# EasyEDA schematic LinefollowerAmateur.json
TITLE: Sheet_1; REV: 1.0; Date: 2025-04-01; Sheet: 1/1; Company: Your Company
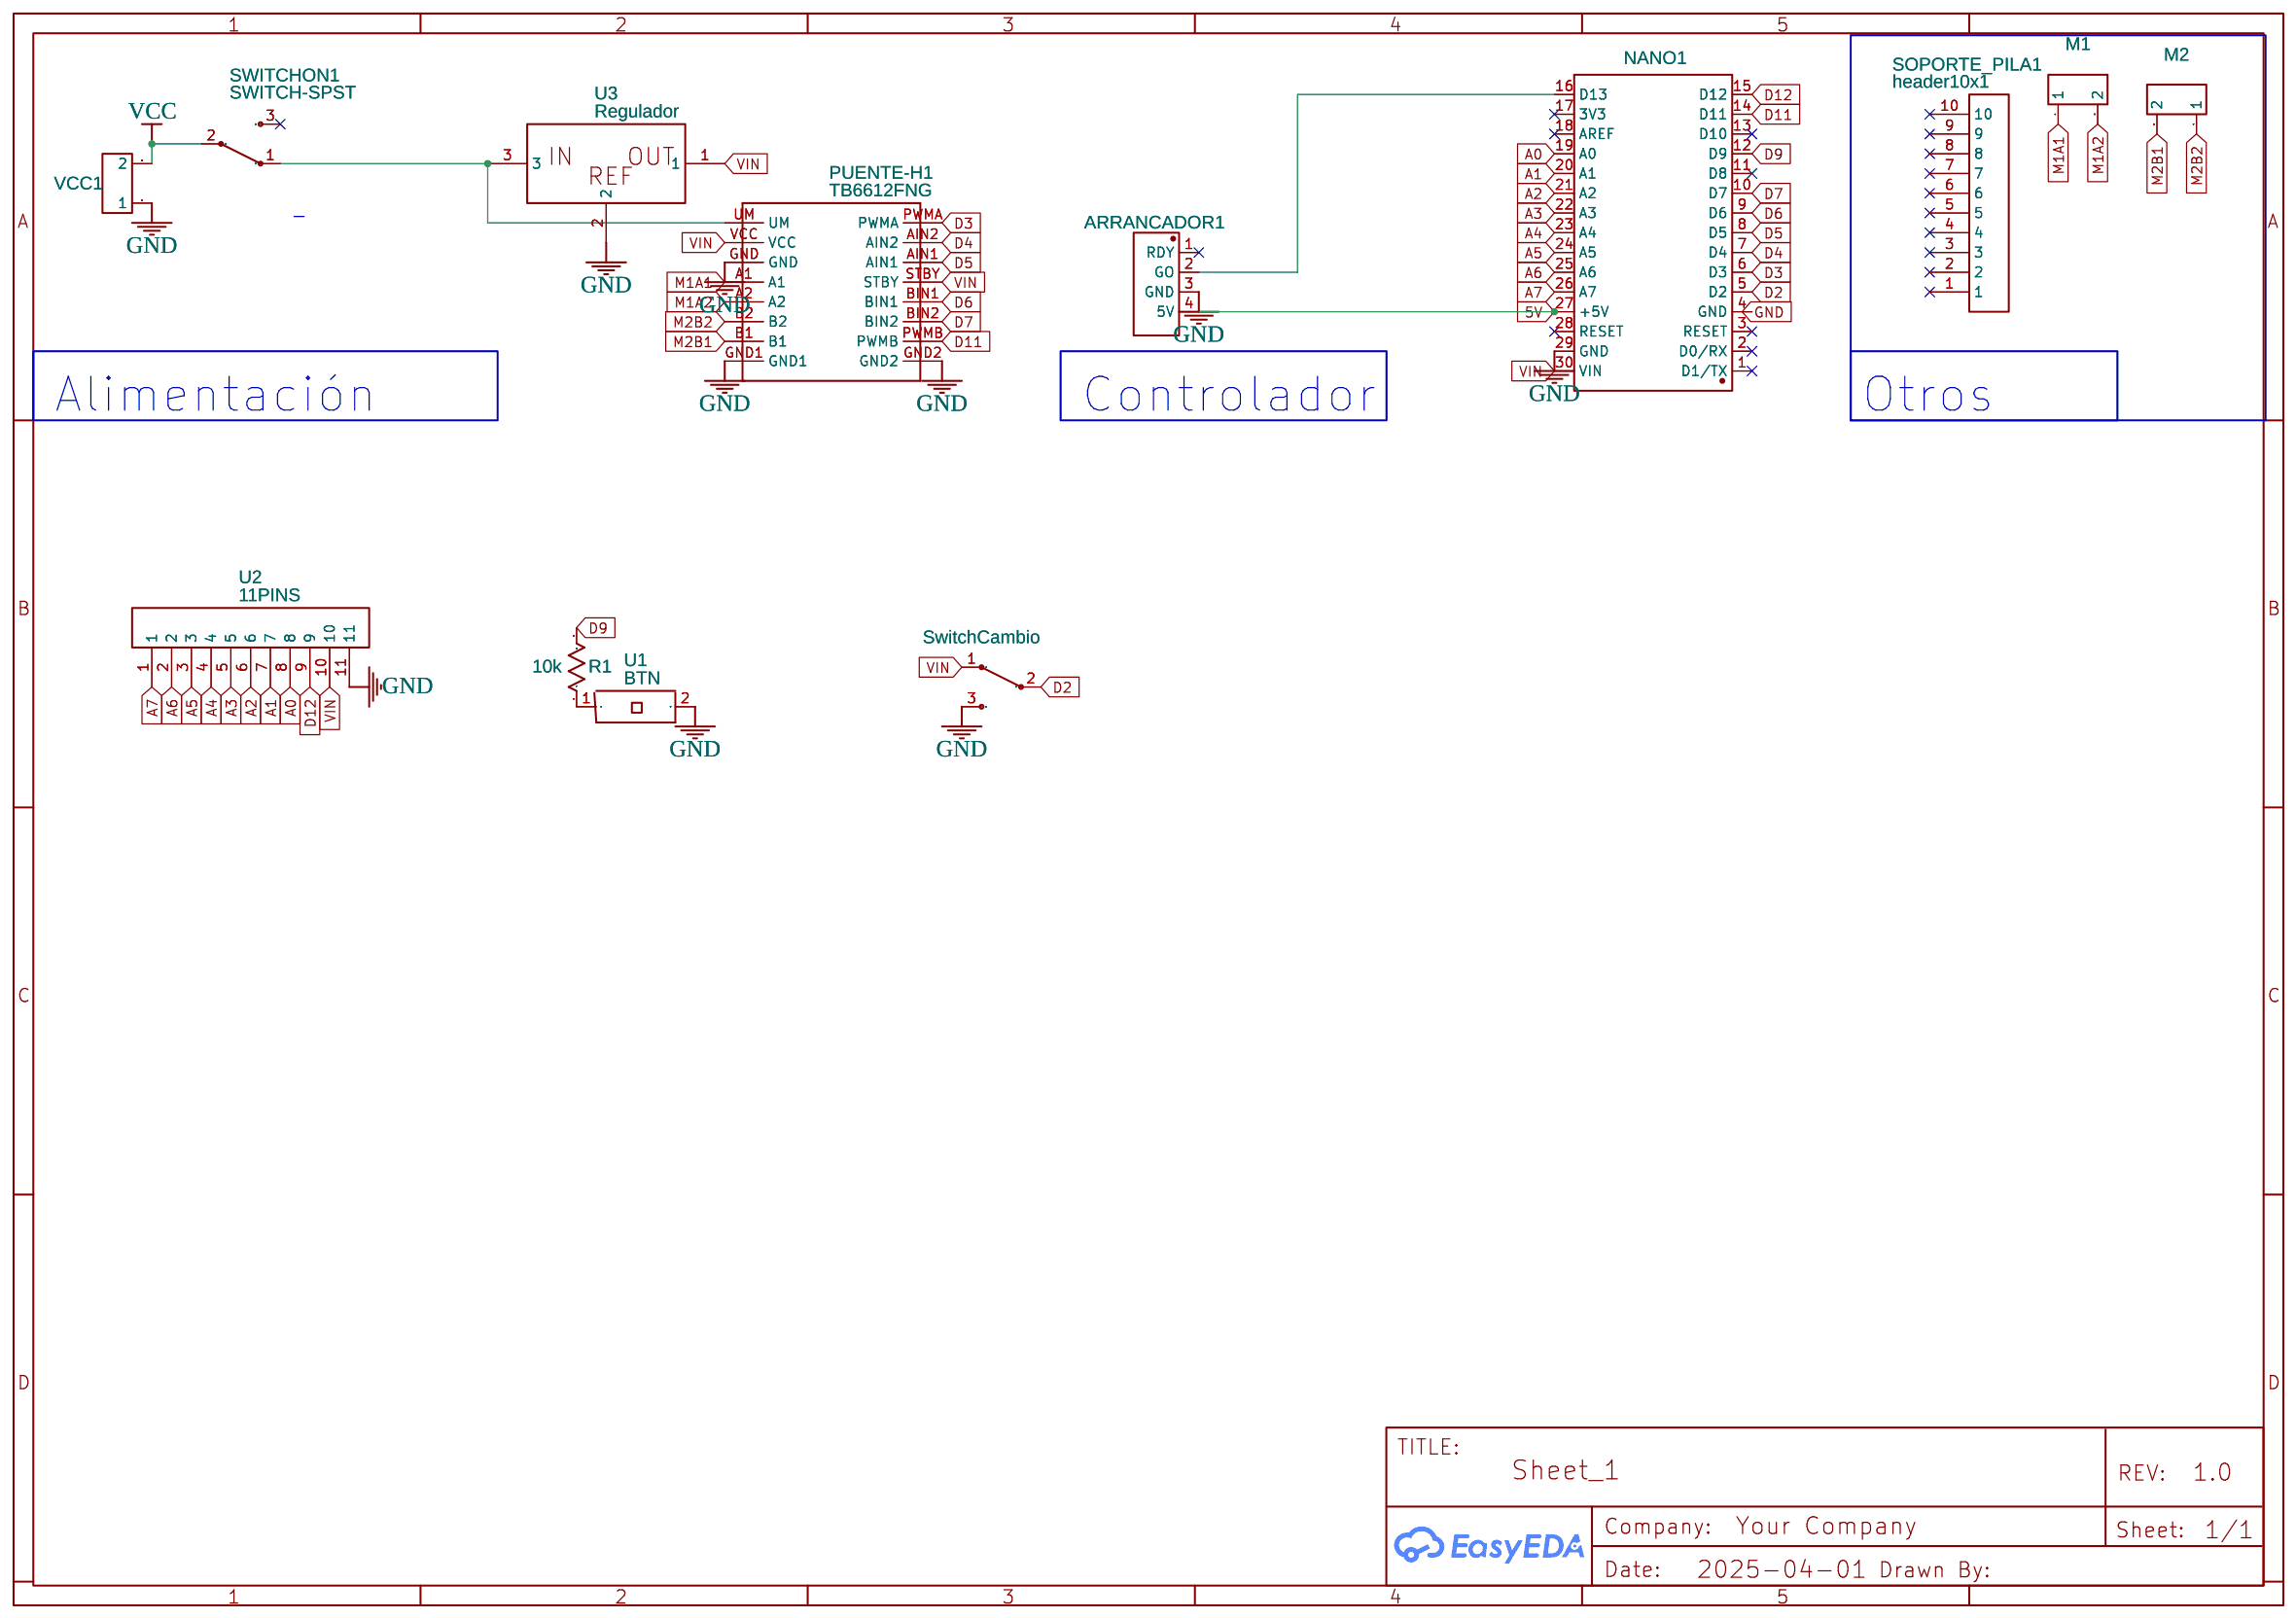
[diagram p0: schematic sheet]

## Parts
ARRANCADOR1  HEADER 1X4P COPY  [HEADER - HEADER-FEMALE-2.54_1X4]
M1  CONNECTOR 2 PINS  [CONNECTOR_PINHEADER_2.54MM:PINHEADER_1X11_P_2.54MM]
M2  CONNECTOR 2 PINS  [CONNECTOR_PINHEADER_2.54MM:PINHEADER_1X11_P_2.54MM]
NANO1  ARDUINO_NANO  [COMM-TH_ARDUINO_NANO]
PUENTE-H1  TB6612FNG  [TB6612FNG]
R1  10k  [PKG-0.25W RESISTOR]
SOPORTE_PILA1  header10x1  [HEADER10X1]
SWITCHCAMBIO1  SwitchCambio  [SWITCH-SPST]
SWITCHON1  SWITCH-SPST  [SWITCH-SPST]
U1  BTN  [BTN]
U2  11PINS  [11PINS]
U3  Regulador  [REGULADOR]
VCC1  CONNECTOR 2 PINS  [CONNECTOR_PINHEADER_2.54MM:PINHEADER_1X11_P_2.54MM]

## Library data of the parts
ARRANCADOR1 = HEADER 1X4P COPY: Contributor: trananhkha2406; Supplier: Sparkfun
M1 M2 VCC1 = HEADER PAD 2X: Manufacturer: BOOMELE; Manufacturer Part: Female headerHDR1X8-2.54; Supplier Part: C27438; JLCPCB Part Class: Extended Part; Contributor: papisdieng22
NANO1 = ARDUINO_NANO: Supplier: LCSC; Supplier Part: C9900017879; Manufacturer: null; JLCPCB Part Class: Extended Part; Contributor: lcsc
PUENTE-H1 = TB6612FNG: Contributor: 3D Mr.
R1 = 10k: Power: 1/4W; Tolerance: ±5%; Supplier Part: 9339116; Supplier: Element14; Manufacturer: MULTICOMP; Manufacturer Part: RESISTOR_ALONG; Link: http://www.farnell.com/datasheets/1716725.pdf?_ga=2.130313612.2023696496.1506695686-238689616.1505921947&_gac=1.45287312.1506011718.EAIaIQobChMI57GX6tq21gIVTzobCh2WXgT2EAAYASAAEgKn9_D_BwE; Contributor: Matheus Alecrim
SOPORTE_PILA1 = header10x1: Contributor: elfred
SWITCHCAMBIO1 SWITCHON1 = SWITCH-SPST: sourceId: ceKgMGAuL; Contributor: Sascha Dahten
U1 = BTN: Contributor: clanganke
U2 = 11PINS: Contributor: Chinz
U3 = Regulador: Contributor: miguelcrego

## Nets
5V: ARRANCADOR1.4(5V) NANO1.27(+5V)
GND: ARRANCADOR1.3(GND) NANO1.4(GND) NANO1.29(GND) PUENTE-H1.GND PUENTE-H1.GND1 PUENTE-H1.GND2 SWITCHCAMBIO1.3 U1.2 U2.11 U3.2 VCC1.1
VCC: SWITCHON1.2 VCC1.2
VIN: NANO1.30(VIN) PUENTE-H1.STBY PUENTE-H1.VCC SWITCHCAMBIO1.1 U2.10 U3.1
A0: NANO1.19(A0) U2.8
A1: NANO1.20(A1) U2.7
A2: NANO1.21(A2) U2.6
A3: NANO1.22(A3) U2.5
A4: NANO1.23(A4) U2.4
A5: NANO1.24(A5) U2.3
A6: NANO1.25(A6) U2.2
A7: NANO1.26(A7) U2.1
D2: NANO1.5(D2) SWITCHCAMBIO1.2
D3: NANO1.6(D3) PUENTE-H1.PWMA
D4: NANO1.7(D4) PUENTE-H1.AIN2
D5: NANO1.8(D5) PUENTE-H1.AIN1
D6: NANO1.9(D6) PUENTE-H1.BIN1
D7: NANO1.10(D7) PUENTE-H1.BIN2
D9: NANO1.12(D9) R1.2
D11: NANO1.14(D11) PUENTE-H1.PWMB
D12: NANO1.15(D12) U2.9
M1A1: M1.1 PUENTE-H1.A1
M1A2: M1.2 PUENTE-H1.A2
M2B1: M2.2 PUENTE-H1.B1
M2B2: M2.1 PUENTE-H1.B2
Net-(ARRANCADOR1-2): ARRANCADOR1.2(GO) NANO1.16(D13)
Net-(PUENTE-H1-UM): PUENTE-H1.UM SWITCHON1.1 U3.3
Net-(R1-1): R1.1 U1.1

Not connected (* = marked no-connect by the designer): ARRANCADOR1 1(RDY)*; NANO1 1(D1/TX)* 2(D0/RX)* 3(RESET)* 11(D8)* 13(D10)* 17(3V3)* 18(AREF)* 28(RESET)*; SOPORTE_PILA1 1* 2* 3* 4* 5* 6* 7* 8* 9* 10*; SWITCHON1 3*

## Notes on the sheet
- -
- Alimentación
- Controlador
- Otros
